# Altium schematic sheet FrontPanelConnectors.SchDoc
size A4; SheetNumber: 5; SheetTotal: 15
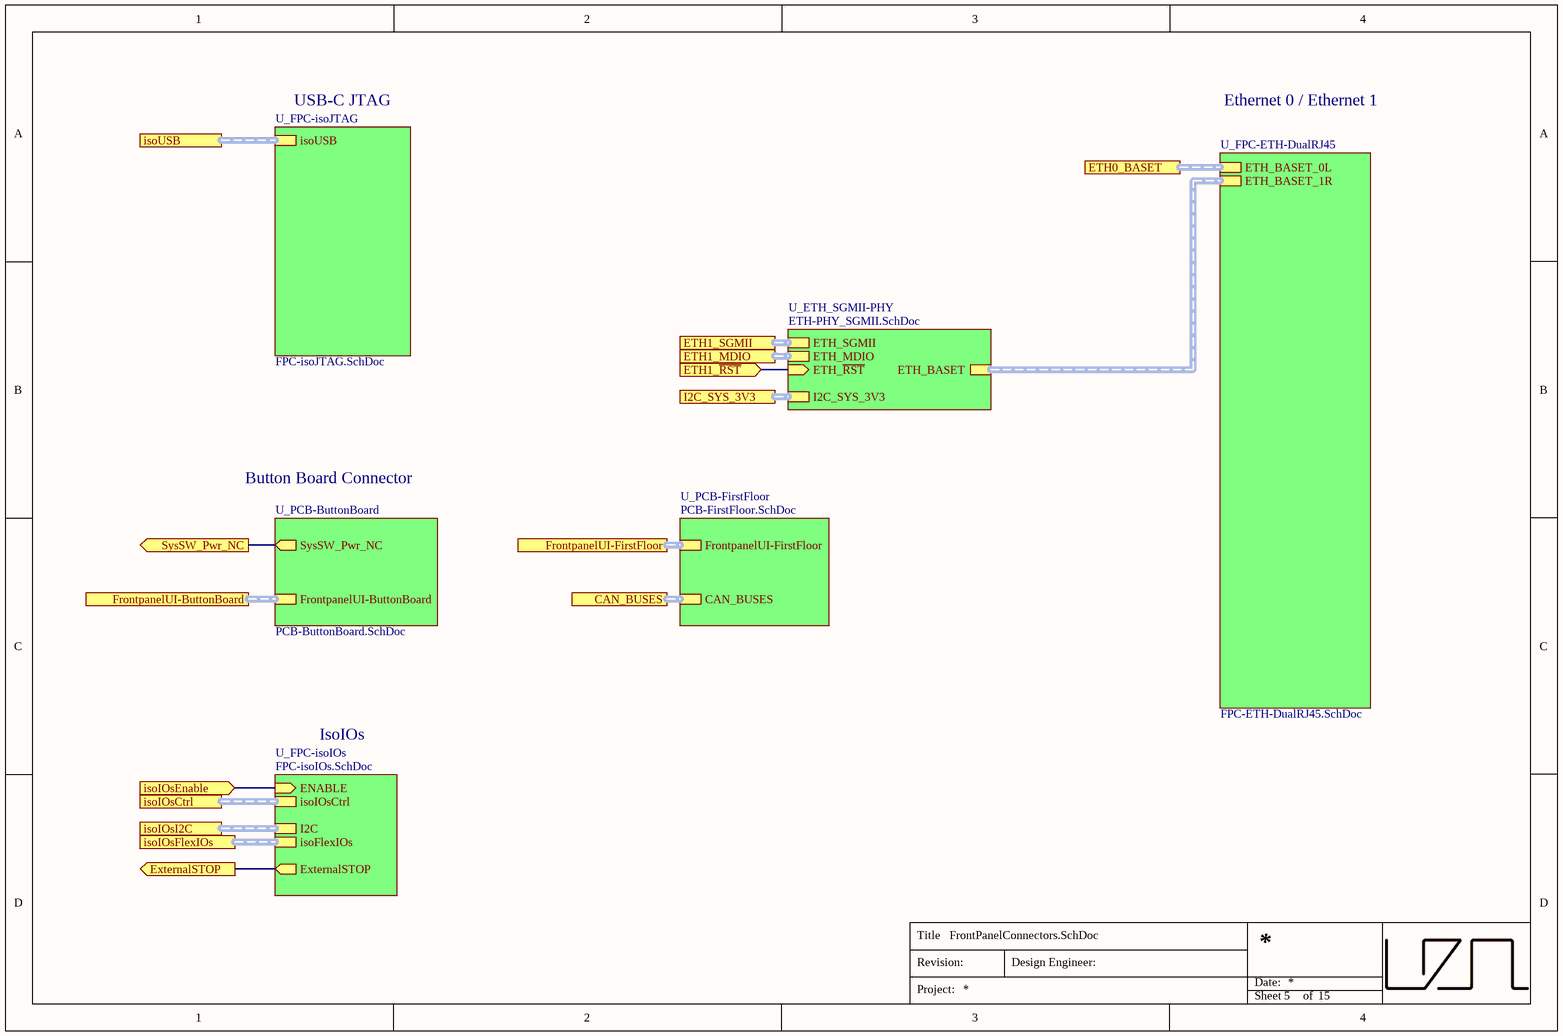
[diagram p0: FrontPanelConnectors.SchDoc]

## Sub-sheets
U_ETH_SGMII-PHY = ETH-PHY_SGMII.SchDoc: ETH_SGMII (harness ETH_SGMII), ETH_MDIO (harness ETH_MDIO), ETH_~{RST} (in), ETH_BASET (harness ETH_BASET), I2C_SYS_3V3 (harness I2C)
U_FPC-ETH-DualRJ45 = FPC-ETH-DualRJ45.SchDoc: ETH_BASET_0L (harness ETH_BASET), ETH_BASET_1R (harness ETH_BASET)
U_FPC-isoIOs = FPC-isoIOs.SchDoc: ENABLE (in), I2C (harness I2C), isoFlexIOs (harness isoFlexIOs), isoIOsCtrl (harness isoIOsCtrl), ExternalSTOP (out)
U_FPC-isoJTAG = FPC-isoJTAG.SchDoc: isoUSB (harness USB)
U_PCB-ButtonBoard = PCB-ButtonBoard.SchDoc: SysSW_Pwr_NC (out), FrontpanelUI-ButtonBoard (harness FrontpanelUI-ButtonBoard)
U_PCB-FirstFloor = PCB-FirstFloor.SchDoc: FrontpanelUI-FirstFloor (harness FrontpanelUI-FirstFloor), CAN_BUSES (harness CAN_BUSES)

## Ports
CAN_BUSES (harness CAN_BUSES), ETH0_BASET (harness ETH_BASET), ETH1_MDIO (harness ETH_MDIO), ETH1_SGMII (harness ETH_SGMII), ETH1_~{RST} (in), ExternalSTOP (out), FrontpanelUI-ButtonBoard (harness FrontpanelUI-ButtonBoard), FrontpanelUI-FirstFloor (harness FrontpanelUI-FirstFloor), I2C_SYS_3V3 (harness I2C), isoIOsCtrl (harness isoIOsCtrl), isoIOsEnable (in), isoIOsFlexIOs (harness isoFlexIOs), isoIOsI2C (harness I2C), isoUSB (harness USB), SysSW_Pwr_NC (out)

## Nets
ETH1_~{RST}: port ETH1_~{RST}, sheet U_ETH_SGMII-PHY/ETH_~{RST}
ExternalSTOP: port ExternalSTOP, sheet U_FPC-isoIOs/ExternalSTOP
isoIOsEnable: port isoIOsEnable, sheet U_FPC-isoIOs/ENABLE
SysSW_Pwr_NC: port SysSW_Pwr_NC, sheet U_PCB-ButtonBoard/SysSW_Pwr_NC

## Buses and harness runs
harness port CAN_BUSES = sheet U_PCB-FirstFloor/CAN_BUSES
harness port ETH0_BASET = sheet U_FPC-ETH-DualRJ45/ETH_BASET_0L
harness port ETH1_MDIO = sheet U_ETH_SGMII-PHY/ETH_MDIO
harness port ETH1_SGMII = sheet U_ETH_SGMII-PHY/ETH_SGMII
harness port FrontpanelUI-ButtonBoard = sheet U_PCB-ButtonBoard/FrontpanelUI-ButtonBoard
harness port FrontpanelUI-FirstFloor = sheet U_PCB-FirstFloor/FrontpanelUI-FirstFloor
harness port I2C_SYS_3V3 = sheet U_ETH_SGMII-PHY/I2C_SYS_3V3
harness port isoIOsCtrl = sheet U_FPC-isoIOs/isoIOsCtrl
harness port isoIOsFlexIOs = sheet U_FPC-isoIOs/isoFlexIOs
harness port isoIOsI2C = sheet U_FPC-isoIOs/I2C
harness port isoUSB = sheet U_FPC-isoJTAG/isoUSB
harness sheet U_ETH_SGMII-PHY/ETH_BASET = sheet U_FPC-ETH-DualRJ45/ETH_BASET_1R

## Notes on the sheet
- USB-C JTAG
- Ethernet 0 / Ethernet 1
- Button Board Connector
- IsoIOs
- Title
- Revision:
- Design Engineer:
- Date:
- Project:
- Sheet
- of